# EAGLE design octave_01 (EAGLE 9.4.0)
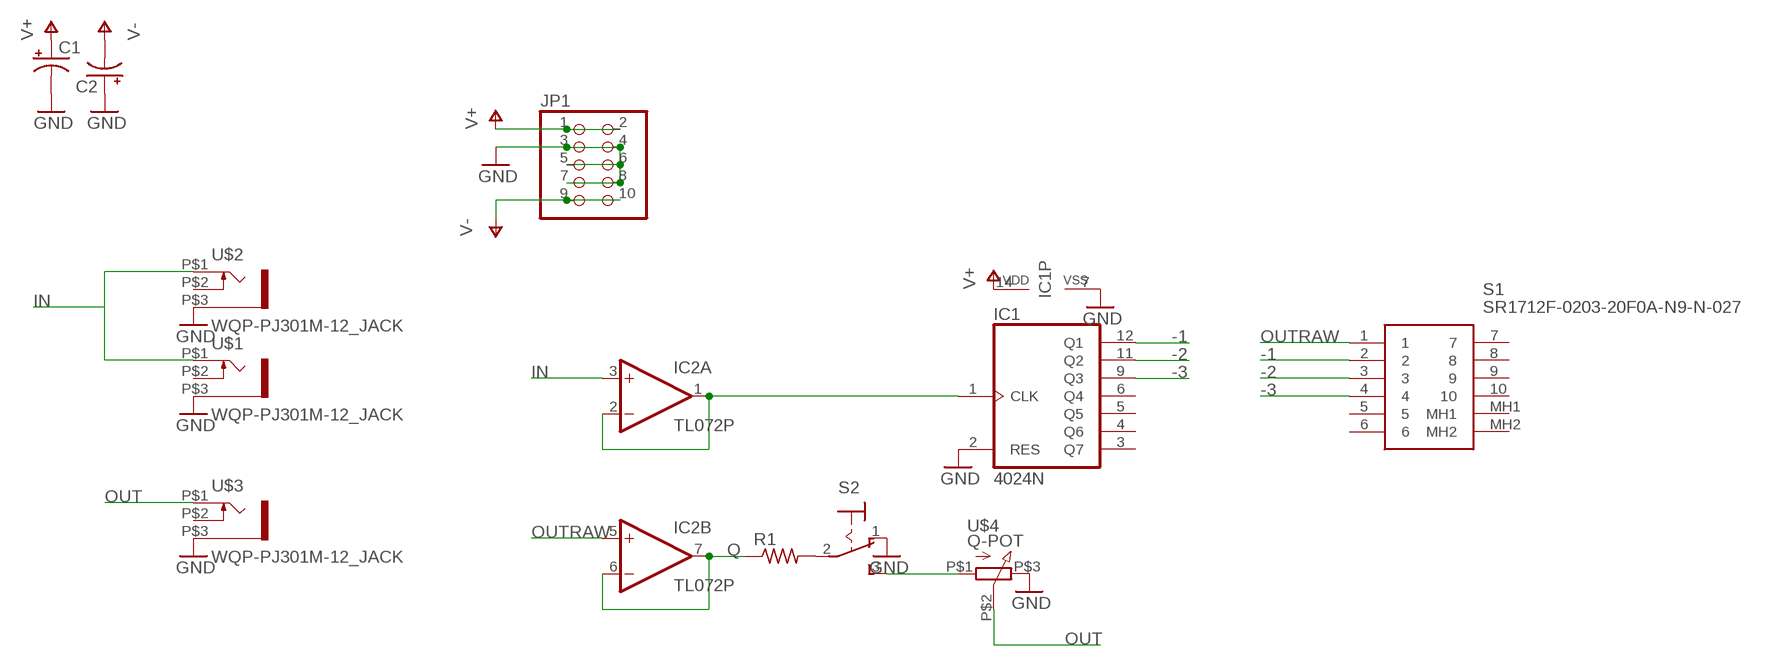
[diagram p0: schematic, sheet 1]

## Parts
C1  CPOL-USE2-4  [E2-4]
C2  CPOL-USE2-4  [E2-4]
IC1  4024N  [DIL14]
IC2  TL072P  [DIL08]
JP1  PINHD-2X5/OCT  [2X05]
R1  R-US_0204/7  [0204/7]
S1  SR1712F-0203-20F0A-N9-N-027  [SR1712F020320F0AN9N027]
S2  M9040P  [M9040P]
U$1  WQP-PJ301M-12_JACK  [WQP-PJ301M-12_JACK]
U$2  WQP-PJ301M-12_JACK  [WQP-PJ301M-12_JACK]
U$3  WQP-PJ301M-12_JACK  [WQP-PJ301M-12_JACK]
U$4  Q-POT  [Q-POT]

## Nets
-1: IC1.12(Q1) S1.2
-2: IC1.11(Q2) S1.3
-3: IC1.9(Q3) S1.4
GND: C1.- C2.+ IC1.2(RES) IC1.7(VSS) JP1.3 JP1.4 JP1.5 JP1.6 JP1.7 JP1.8 S2.1(O) U$1.P$3 U$2.P$3 U$3.P$3 U$4.P$3
IN: IC2.3(A:+IN) U$1.P$1 U$2.P$1
N$1: IC1.1(CLK) IC2.1(A:OUT) IC2.2(A:-IN)
N$2: R1.2 S2.2(P) S2.3(S) U$4.P$1
OUT: U$3.P$1 U$4.P$2
OUTRAW: IC2.5(B:+IN) S1.1
Q: IC2.6(B:-IN) IC2.7(B:OUT) R1.1
V+: C1.+ IC1.14(VDD) JP1.1 JP1.2
V-: C2.- JP1.9 JP1.10
Unconnected: IC1.3(Q7) IC1.4(Q6) IC1.5(Q5) IC1.6(Q4) S1.5 S1.6 S1.7 S1.8 S1.9 S1.10 S1.MH1 S1.MH2 U$1.P$2 U$2.P$2 U$3.P$2

## Power pins joined to a net without a drawn wire
V+: IC2.8(P:V+)
V-: IC2.4(P:V-)

## Library data of the parts
C1 C2 = adafruit:CPOL-US: POLARIZED CAPACITOR, American symbol
IC1 = 40xx:4024: 7-stage binary/ripple COUNTER
IC2 = linear:TL072: OP AMP
JP1 = pinhead_v2:PINHD-2X5: PIN HEADER
R1 = adafruit:R-US_: RESISTOR, American symbol
S1 = SamacSys_Parts:SR1712F-0203-20F0A-N9-N-027: Rotary Switches 2 POLE 3 POS D SHAFT Source: Datasheet <https://componentsearchengine.com/Datasheets/1/SR1712F-0203-20F0A-N9-N-027.pdf>; DESCRIPTION: Rotary Switches 2 POLE 3 POS D SHAFT; HEIGHT: 27.5mm; MANUFACTURER_NAME: Alpha (Taiwan); MANUFACTURER_PART_NUMBER: SR1712F-0203-20F0A-N9-N-027; MOUSER_PART_NUMBER: 105-SR1712F-23NS; MOUSER_PRICE-STOCK: https://www.mouser.com/Search/Refine.aspx?Keyword=105-SR1712F-23NS
S2 = switch:M9040P: TOGGLE SWITCH Marquardt
U$1-U$3 = thonkiconn:WQP-PJ301M-12_JACK
U$4 = Pure_ADSR_SMD_V2_1:Q-POT

## Board
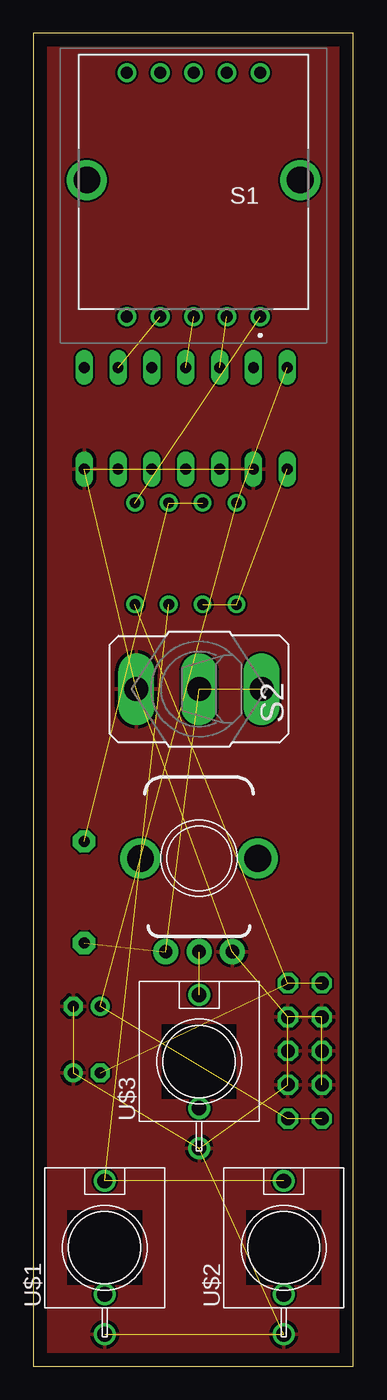
[diagram p1: board, top side]
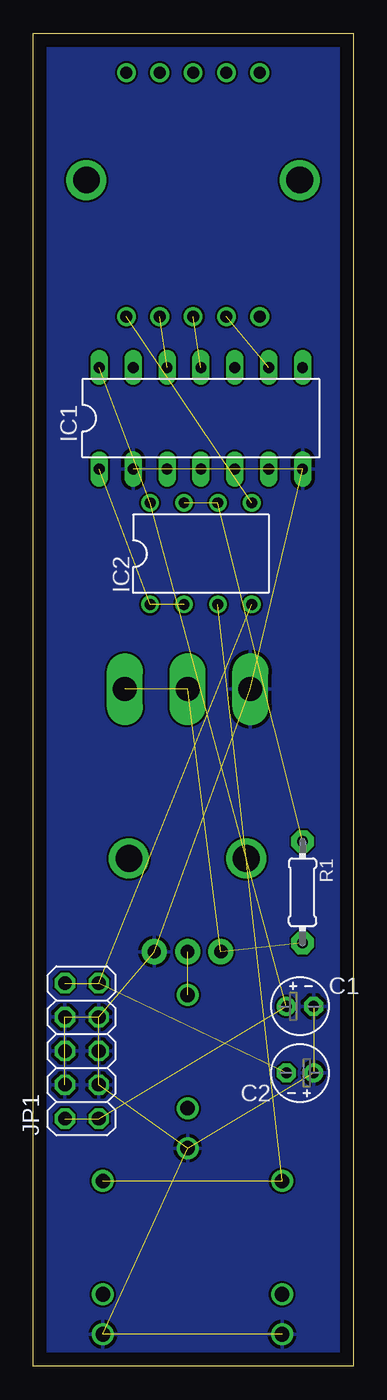
[diagram p2: board, bottom side, seen from below]

Size 24 x 100 mm. Coordinates in mm from the lower left corner, seen from the top.
Outline: 0,0 24,0 24,100 0,100 0,0
Copper layers (1*16): Top 0.035mm / dielectric 1.5mm / Bottom 0.035mm
Design rules "default *": minimum track width 10mil, minimum drill 0.35mm, track to track 6mil, track to pad 6mil, pad to pad 6mil, via to via 6mil, smd to smd 6mil, copper to edge 40mil, drill to drill 6mil, minimum pad ring 10mil, minimum via ring 8mil, stop-mask expansion 4mil, vias tented up to drill 0mil, thermal gap 10mil

### Footprints (pad centres in the part's own frame; a part is rotated, then mirrored left to right if it is on the bottom)
E2-4 = drill 0.813 pad 1.422: + -1.016,0 | drill 0.813 pad 1.422 octagon: - 1.016,0
DIL14 = drill 0.813 long: 1 -7.62,-3.81; 2 -5.08,-3.81; 3 -2.54,-3.81; 4 0,-3.81; 5 2.54,-3.81; 6 5.08,-3.81; 7 7.62,-3.81; 8 7.62,3.81; 9 5.08,3.81; 10 2.54,3.81; 11 0,3.81; 12 -2.54,3.81; 13 -5.08,3.81; 14 -7.62,3.81
DIL08 = drill 0.813 pad 1.27: 1 -3.81,-3.81; 2 -1.27,-3.81; 3 1.27,-3.81; 4 3.81,-3.81; 5 3.81,3.81; 6 1.27,3.81; 7 -1.27,3.81; 8 -3.81,3.81
2X05 = drill 1.016 octagon: 1 -5.08,-1.27; 2 -5.08,1.27; 3 -2.54,-1.27; 4 -2.54,1.27; 5 0,-1.27; 6 0,1.27; 7 2.54,-1.27; 8 2.54,1.27; 9 5.08,-1.27; 10 5.08,1.27
0204/7 = drill 0.813 pad 1.676 octagon: 1 -3.81,0; 2 3.81,0
SR1712F020320F0AN9N027 = drill 0.9 pad 1.4: 1 0,0; 2 -2.5,0; 3 -5,0; 4 -7.5,0; 5 -10,0; 6 -10,18.3; 7 -7.5,18.3; 8 -5,18.3; 9 -2.5,18.3; 10 0,18.3 | drill 2 pad 3: MH1 3,10.25; MH2 -13,10.25
M9040P = drill 1.803 long: 1 0,4.699; 2 0,0; 3 0,-4.699
WQP-PJ301M-12_JACK = drill 1.1: P$1 0,5; P$2 0,-3.5; P$3 0,-6.5
Q-POT = drill 1 pad 1.88: P$1 -2.5,-7; P$2 0,-7; P$3 2.5,-7 | drill 2 pad 2.68: P$4 -4.4,0; P$5 4.4,0

### Placement (x,y rotation side)
C1  4,27 0 bottom
C2  4,22 180 bottom
IC1  11.43,71.12 0 bottom
IC2  11.43,60.96 0 bottom
JP1  20.36,23.65 90 bottom
R1  3.81,35.56 270 bottom
S1  17.02,78.74 0 top
S2  12.43,50.8 90 top
U$1  5.35,8.89 0 top
U$2  18.78,8.89 0 top
U$3  12.43,22.86 0 top
U$4  12.43,38.1 0 top

### Tracks (layer width: path | path; a pad name or v marks a point on that pad's centre or on a via)
-1  (1 unrouted)
-2  (1 unrouted)
-3  (1 unrouted)
GND  (14 unrouted)
  pour Top: 0,100 24,100 24,0 0,0
  pour Bottom: 0,100 0,0 24,0 24,100
IN  (2 unrouted)
N$1  (2 unrouted)
N$2  (3 unrouted)
OUT  (1 unrouted)
OUTRAW  (1 unrouted)
Q  (2 unrouted)
V+  (4 unrouted)
V-  (3 unrouted)